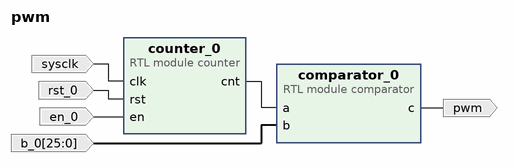
[diagram p0: block diagram of the top level]
# Vivado block design pwm, xc7k70tfbv676-1, Vivado 2020.2
create_bd_design pwm

create_bd_port -dir I -type clk sysclk
create_bd_port -dir I -type rst rst_0
create_bd_port -dir O pwm
create_bd_port -dir I en_0
create_bd_port -dir I -from 25 -to 0 b_0

create_bd_cell -type module -reference counter counter_0
create_bd_cell -type module -reference comparator comparator_0

# ---- connections ----

connect_bd_net -net clk_0_1 [get_bd_ports sysclk] [get_bd_pins counter_0/clk]
connect_bd_net -net rst_0_1 [get_bd_ports rst_0] [get_bd_pins counter_0/rst]
connect_bd_net [get_bd_pins comparator_0/c] [get_bd_ports pwm]
connect_bd_net [get_bd_pins counter_0/cnt] [get_bd_pins comparator_0/a]
connect_bd_net -net en_0_1 [get_bd_ports en_0] [get_bd_pins counter_0/en]
connect_bd_net -net b_0_1 [get_bd_ports b_0] [get_bd_pins comparator_0/b]

validate_bd_design
save_bd_design
